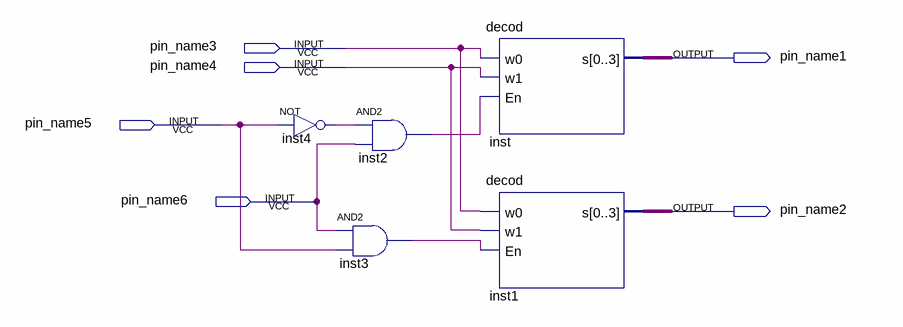
[diagram p0: schematic sheet]
// Quartus schematic decodModifiedWF.bdf as structural Verilog: 5 symbols, 6 pins
module decodModifiedWF (
  input  pin_name3,
  input  pin_name4,
  input  pin_name5,
  input  pin_name6,
  output pin_name1,
  output pin_name2
);

  wire inst2_out, inst3_out, inst4_out;
  wire [3:0] inst1_s, inst_s;

  not inst4 (inst4_out, pin_name5);
  and inst3 (inst3_out, pin_name6, pin_name5);
  and inst2 (inst2_out, inst4_out, pin_name6);
  decod inst (.w0(pin_name3), .w1(pin_name4), .En(inst2_out), .s(inst_s));
  decod inst1 (.w0(pin_name3), .w1(pin_name4), .En(inst3_out), .s(inst1_s));
endmodule
